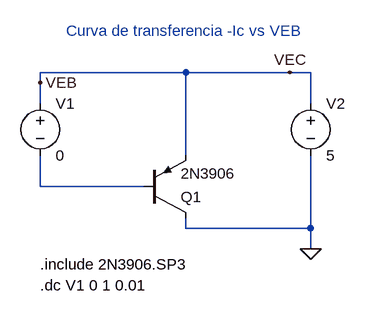
[diagram p0: schematic sim_bjt_transfer.asc]
sim_bjt_transfer.asc, the LTspice schematic file:
Version 4
SHEET 1 880 680
WIRE 112 96 -112 96
WIRE 272 96 112 96
WIRE 304 96 272 96
WIRE -112 112 -112 96
WIRE -112 144 -112 112
WIRE 304 144 304 96
WIRE 112 224 112 96
WIRE -112 272 -112 224
WIRE 48 272 -112 272
WIRE 112 336 112 320
WIRE 304 336 304 224
WIRE 304 336 112 336
WIRE 304 368 304 336
FLAG 304 368 0
FLAG 272 96 VEC
FLAG -112 112 VEB
SYMBOL voltage -112 128 R0
SYMATTR InstName V1
SYMATTR Value 0
SYMBOL voltage 304 128 R0
SYMATTR InstName V2
SYMATTR Value 5
SYMBOL pnp 48 320 M180
SYMATTR InstName Q1
SYMATTR Value 2N3906
TEXT -112 392 Left 2 !.include 2N3906.SP3
TEXT -112 424 Left 2 !.dc V1 0 1 0.01
TEXT -72 32 Left 2 ;Curva de transferencia -Ic vs VEB

The netlist it stands for:
* sim_bjt_transfer.asc
V1 VEB N001 0
V2 VEB 0 5
Q1 0 N001 VEB 0 2N3906
.model NPN NPN
.model PNP PNP
.lib standard.bjt
.include 2N3906.SP3
.dc V1 0 1 0.01
* Curva de transferencia -Ic vs VEB
.backanno
.end

* Results of the author's LTspice run, read from the files saved beside the schematic
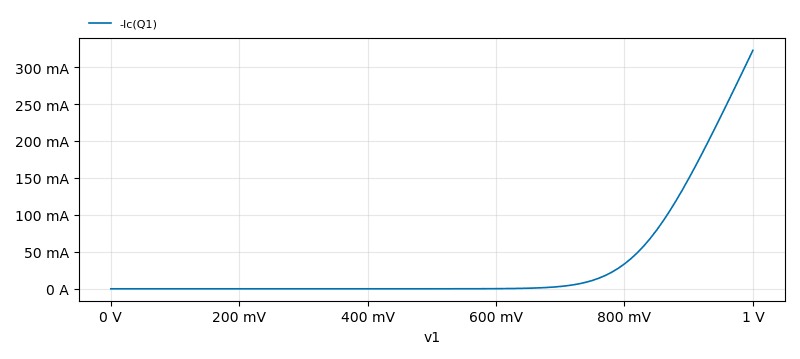
[diagram p1: DC transfer characteristic of sim_bjt_transfer.asc, plotted from the saved traces]
* DC transfer characteristic, 1 run:
*   -Ic(Q1): 779.6 pA at v1=0 V, 322.6 mA at v1=1 V, min 779.6 pA, max 322.6 mA